# Altium project user_interface.PrjPcb
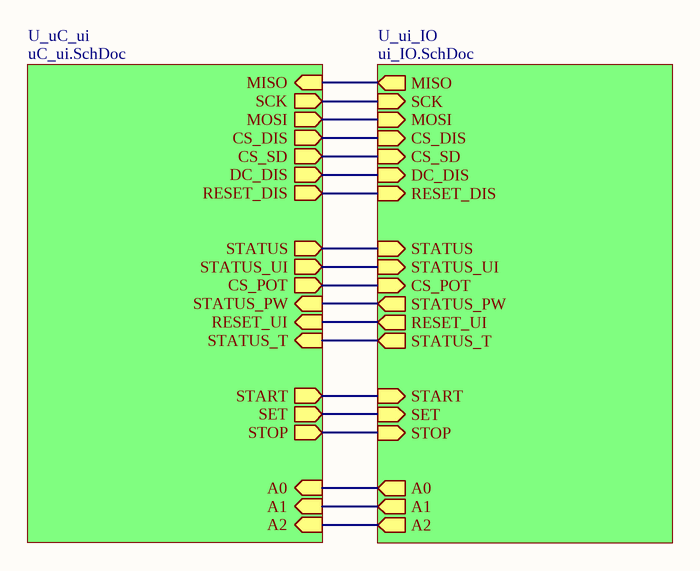
[diagram p0: top_level.SchDoc]
3 sheets, 32 parts. Net scope: hierarchical (ports join the sheet entries above them; power ports are global).
Board file: ui_pcb.PcbDoc
Sheets:
  top_level.SchDoc
    U_uC_ui = uC_ui.SchDoc
    U_ui_IO = ui_IO.SchDoc

## Sheet top_level.SchDoc
size A4

### Sub-sheets
U_uC_ui = uC_ui.SchDoc: A0 (in), A1 (in), A2 (in), CS_SD (out), STATUS_UI (out), STATUS_PW (in), CS_DIS (out), MOSI (out), MISO (in), SCK (out), STATUS_T (in), STATUS (out), SET (out), START (out), STOP (out), CS_POT (out), RESET_DIS (out), DC_DIS (out), RESET_UI (in)
U_ui_IO = ui_IO.SchDoc: MISO (out), RESET_DIS (in), DC_DIS (in), CS_DIS (in), A0 (out), A1 (out), START (in), STOP (in), STATUS_PW (out), STATUS_UI (in), RESET_UI (out), STATUS_T (out), STATUS (in), SET (in), CS_SD (in), CS_POT (in), SCK (in), MOSI (in), A2 (out)

### Nets
MOSI: sheet U_uC_ui/MOSI, sheet U_ui_IO/MOSI
RESET_UI: sheet U_uC_ui/RESET_UI, sheet U_ui_IO/RESET_UI
SCK: sheet U_uC_ui/SCK, sheet U_ui_IO/SCK
STATUS: sheet U_uC_ui/STATUS, sheet U_ui_IO/STATUS
STATUS_PW: sheet U_uC_ui/STATUS_PW, sheet U_ui_IO/STATUS_PW
STATUS_T: sheet U_uC_ui/STATUS_T, sheet U_ui_IO/STATUS_T
STATUS_UI: sheet U_uC_ui/STATUS_UI, sheet U_ui_IO/STATUS_UI
NetJ1_1: sheet U_uC_ui/MISO, sheet U_ui_IO/MISO
NetJ1_4: sheet U_uC_ui/CS_DIS, sheet U_ui_IO/CS_DIS
NetJ1_5: sheet U_uC_ui/CS_SD, sheet U_ui_IO/CS_SD
NetJ1_6: sheet U_uC_ui/DC_DIS, sheet U_ui_IO/DC_DIS
NetJ1_7: sheet U_uC_ui/RESET_DIS, sheet U_ui_IO/RESET_DIS
NetP1_4: sheet U_uC_ui/CS_POT, sheet U_ui_IO/CS_POT
NetP3_3: sheet U_uC_ui/STOP, sheet U_ui_IO/STOP
NetP3_4: sheet U_uC_ui/SET, sheet U_ui_IO/SET
NetP3_5: sheet U_uC_ui/START, sheet U_ui_IO/START
NetR6_1: sheet U_uC_ui/A0, sheet U_ui_IO/A0
NetR9_1: sheet U_uC_ui/A1, sheet U_ui_IO/A1
NetR11_1: sheet U_uC_ui/A2, sheet U_ui_IO/A2

## Sheet uC_ui.SchDoc
size A4
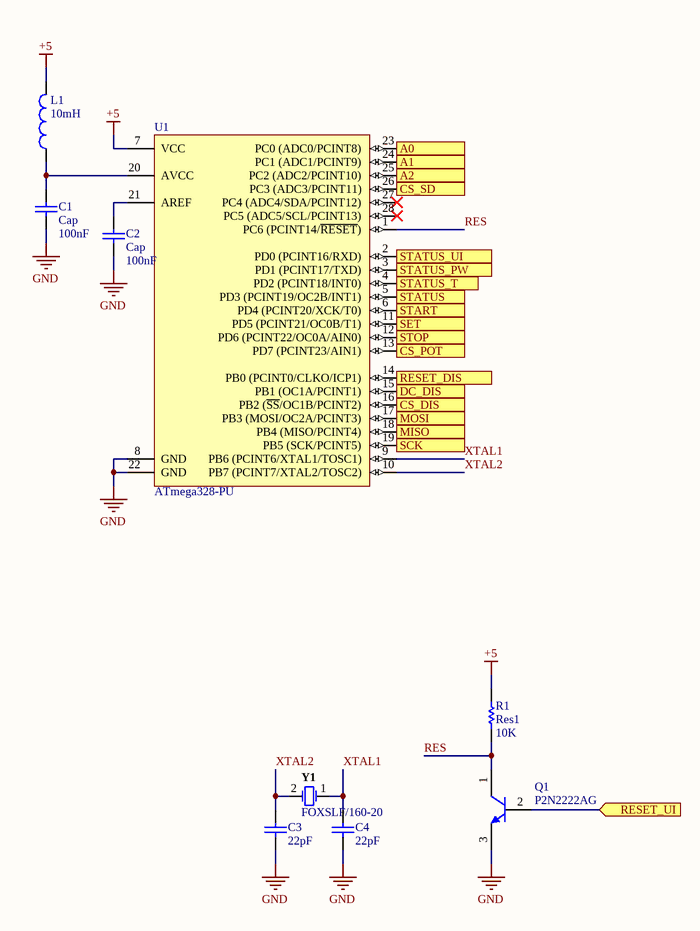
[diagram p1: uC_ui.SchDoc]

### Parts
C1  Cap  value 100nF  [RAD-0.3]
C2  Cap  value 100nF  [RAD-0.3]
C3  value 22pF  [RAD-0.3]  (hidden comment: Cap)
C4  value 22pF  [RAD-0.3]  (hidden comment: Cap)
L1  10mH  [INDR62-500-1100X850X1100]
Q1  P2N2222AG  [ONSC-TO-92-3-29-11]
R1  Res1  value 10K  [AXIAL-0.4]
U1  ATmega328-PU  [28P3]
Y1  FOXSLF/160-20  [FOX-FOXSLF160-20]

### Ports
A0 (in), A1 (in), A2 (in), CS_DIS (out), CS_POT (out), CS_SD (out), DC_DIS (out), MISO (in), MOSI (out), RESET_DIS (out), RESET_UI (in), SCK (out), SET (out), START (out), STATUS (out), STATUS_PW (in), STATUS_T (in), STATUS_UI (out), STOP (out)

### Nets
+5: L1.2 R1.2 U1.7(VCC)
GND: C1.1 C2.1 C3.1 C4.1 Q1.3(E) U1.8(GND) U1.22(GND)
MOSI: U1.17(PB3_(MOSI/OC2A/PCINT3)) ; port MOSI
RES: Q1.1(C) R1.1 U1.1(PC6_(PCINT14/~{RESET}))
RESET_UI: Q1.2(B) ; port RESET_UI
SCK: U1.19(PB5_(SCK/PCINT5)) ; port SCK
STATUS: U1.5(PD3_(PCINT19/OC2B/INT1)) ; port STATUS
STATUS_PW: U1.3(PD1_(PCINT17/TXD)) ; port STATUS_PW
STATUS_T: U1.4(PD2_(PCINT18/INT0)) ; port STATUS_T
STATUS_UI: U1.2(PD0_(PCINT16/RXD)) ; port STATUS_UI
XTAL1: C4.2 U1.9(PB6_(PCINT6/XTAL1/TOSC1)) Y1.1
XTAL2: C3.2 U1.10(PB7_(PCINT7/XTAL2/TOSC2)) Y1.2
NetC1_2: C1.2 L1.1 U1.20(AVCC)
NetC2_2: C2.2 U1.21(AREF)
NetJ1_1: U1.18(PB4_(MISO/PCINT4)) ; port MISO
NetJ1_4: U1.16(PB2_(~{SS}/OC1B/PCINT2)) ; port CS_DIS
NetJ1_5: U1.26(PC3_(ADC3/PCINT11)) ; port CS_SD
NetJ1_6: U1.15(PB1_(OC1A/PCINT1)) ; port DC_DIS
NetJ1_7: U1.14(PB0_(PCINT0/CLKO/ICP1)) ; port RESET_DIS
NetP1_4: U1.13(PD7_(PCINT23/AIN1)) ; port CS_POT
NetP3_3: U1.12(PD6_(PCINT22/OC0A/AIN0)) ; port STOP
NetP3_4: U1.11(PD5_(PCINT21/OC0B/T1)) ; port SET
NetP3_5: U1.6(PD4_(PCINT20/XCK/T0)) ; port START
NetR6_1: U1.23(PC0_(ADC0/PCINT8)) ; port A0
NetR9_1: U1.24(PC1_(ADC1/PCINT9)) ; port A1
NetR11_1: U1.25(PC2_(ADC2/PCINT10)) ; port A2

Not connected (* = marked no-connect by the designer): U1 27(PC4_(ADC4/SDA/PCINT12))* 28(PC5_(ADC5/SCL/PCINT13))*

### Library data of the parts
C1-C4 = Cap: Capacitor; Published: 8-Jun-2000; LatestRevisionDate: 17-Jul-2002; LatestRevisionNote: Re-released for DXP Platform.; PackageReference: RAD-0.3; Publisher: Altium Limited; PackageDescription: Radial Cap, Thru-Hole; 2 Leads; 0.3 in Pin Spacing
L1 = CMP-1747-00016-1: Radial Inductor, 10 uH, +/- 10%, 3 A, -55 to 105 degC, 2-Pin THD, RoHS, Bulk; Outputs: 4; Case\Package: DIP; Output Voltage: 36 V; Interface: Parallel; Min Supply Voltage: 4.5 V; Output Current: 600 mA; Max Operating Temperature: 70 degC; PackageDescription: 2-Pin Radial Lead, Dia 8.5 mm, Pitch 5 mm; Min Operating Temperature: 0 degC; ComponentLink2Description: Datasheet; Mount: Through Hole; PackageReference: INDR62-500-1100X850X1100; REACH SVHC: No SVHC; Width: 0.25 inch; Package Quantity: 25; ComponentLink1Description: Manufacturer URL; Height: 0.25 inch; DatasheetVersion: Aug-10; Packaging: Rail/Tube; Length: 0.75 inch; Max Supply Voltage: 36 V; RoHSCompliant: true; ComponentLink1URL: http://www.bourns.com/; Radiation Hardening: No; Weight: 0.03357 oz; Pins: 16; ComponentLink2URL: http://www.bourns.com/docs/Product-Datasheets/rl622_series.pdf
Q1 = CMP-1048-01402-1: Amplifier Transistor, NPN Silicon, 3-Pin TO-92, Pb-Free, Bulk Box; Manufacturer: On Semiconductor; IC Continuous (A): 0.6; fT Min (MHz): 300; ComponentLink2Description: Datasheet; ComponentLink1Description: Manufacturer URL; ComponentLink2URL: http://www.onsemi.com/pub_link/Collateral/P2N2222A-D.PDF; ComponentLink3Description: Package Specification; RoHS: TRUE; ComponentLink1URL: http://www.onsemi.com/; PartNumber: P2N2222AG; Mounting Technology: Through Hole; PackageReference: TO-92-3-29-11_AM_SL; Polarity: NPN; Packing: Bulk Box; DatasheetVersion: Rev. 7; PackageDescription: 3-Pin Transistor Outline, Body 4.825 x 3.685 mm, Pitch 1.27 mm; PackageVersion: Rev. AM; ComponentLink3URL: http://www.onsemi.cn/pub_link/Collateral/2N6426-D.PDF
R1 = Res1: Resistor; Published: 8-Jun-2000; LatestRevisionDate: 17-Jul-2002; LatestRevisionNote: Re-released for DXP Platform.; PackageReference: AXIAL-0.3; Publisher: Altium Limited; PackageDescription: Axial Device, Thru-Hole; 2 Leads; 0.3 in Pin Spacing
U1 = CMP-0095-00015-2: 8-bit AVR Microcontroller, 32KB Flash, 1KB EEPROM, 2KB SRAM, 28-pin PDIP, Industrial Grade (-40°C to 85°C); ComponentLink3Description: ATmega48A/48PA/88A/88PA/168A/168PA/328/328P Summary; RevisionNote: DatasheetVersion updated. URLs added.; DatasheetVersion: revD, May-2011; ComponentLink1URL: http://www.atmel.com/; PackageVersion: revB, Sep-2001; PackageDescription: 28-lead (0.300"/7.62mm Wide) Plastic Dual Inline Package (PDIP); PackageReference: 28P3; ComponentLink1Description: Manufacturer URL; ComponentLink2Description: ATmega48A/48PA/88A/88PA/168A/168PA/328/328P Datasheet; ComponentLink3URL: http://www.atmel.com/dyn/resources/prod_documents/8271S.pdf; ComponentLink2URL: http://www.atmel.com/dyn/resources/prod_documents/8271.pdf
Y1 = CMP-1749-00003-1: Resistance Weld Thru-Hole Crystal, 16 MHz, -20 to 70 degC, 2-Pin THD, RoHS, Bulk; Voltage Rating: 250 V; Tolerance: 1%; Resistance: 221 kohm; Case\Package: Axial; Power Rating: 250 mW; RoHSCompliant: true; Package Quantity: 200; Packaging: Bulk; Min Operating Temperature: -55 degC; DatasheetVersion: Mar-15; ComponentLink1URL: http://www.foxonline.com/; Max Operating Temperature: 155 degC; PackageReference: FOXSLF160-20; Mount: Through Hole; PackageDescription: 2-Pin Through Hole Device, Body 11.35 x 4.65 mm; ComponentLink1Description: Manufacturer URL; ComponentLink2URL: http://www.foxonline.com/pdfs/hc49slf.pdf; ComponentLink2Description: Datasheet; Length: 0.248 inch

## Sheet ui_IO.SchDoc
size A4
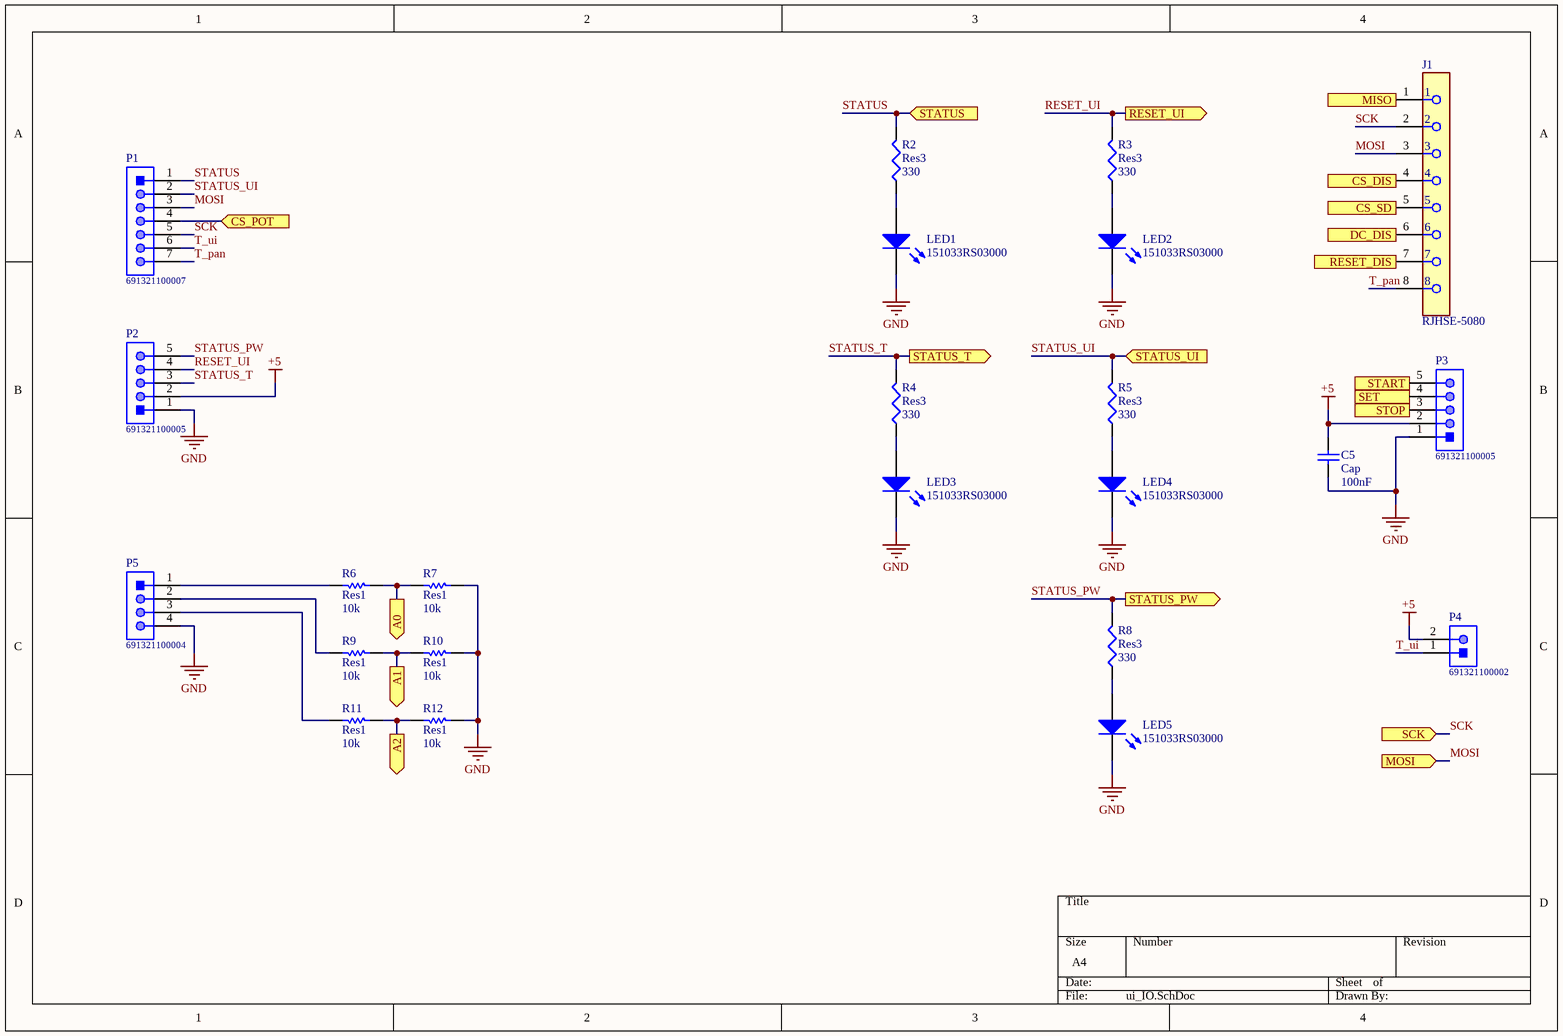
[diagram p2: ui_IO.SchDoc]

### Parts
C5  Cap  value 100nF  [RAD-0.3]
J1  RJHSE-5080  [FP-RJHSE-5080-MFG]
LED1  151033RS03000  [Type 3mm]
LED2  151033RS03000  [Type 3mm]
LED3  151033RS03000  [Type 3mm]
LED4  151033RS03000  [Type 3mm]
LED5  151033RS03000  [Type 3mm]
P1  691321100007  [691321100007]
P2  691321100005  [691321100005]
P3  691321100005  [691321100005]
P4  691321100002  [691321100002]
P5  691321100004  [691321100004]
R2  Res3  value 330  [AXIAL-0.4]
R3  Res3  value 330  [AXIAL-0.4]
R4  Res3  value 330  [AXIAL-0.4]
R5  Res3  value 330  [AXIAL-0.4]
R6  Res1  value 10k  [AXIAL-0.4]
R7  Res1  value 10k  [AXIAL-0.4]
R8  Res3  value 330  [AXIAL-0.4]
R9  Res1  value 10k  [AXIAL-0.4]
R10  Res1  value 10k  [AXIAL-0.4]
R11  Res1  value 10k  [AXIAL-0.4]
R12  Res1  value 10k  [AXIAL-0.4]

### Ports
A0 (out), A1 (out), A2 (out), CS_DIS (in), CS_POT (in), CS_SD (in), DC_DIS (in), MISO (out), MOSI (in), RESET_DIS (in), RESET_UI (out), SCK (in), SET (in), START (in), STATUS (in), STATUS_PW (out), STATUS_T (out), STATUS_UI (in), STOP (in)

### Nets
+5: C5.2 P2.2 P3.2 P4.2
GND: C5.1 LED1.1(K) LED2.1(K) LED3.1(K) LED4.1(K) LED5.1(K) P2.1 P3.1 P5.4 R7.1 R10.1 R12.1
MOSI: J1.3 P1.3 ; port MOSI
RESET_UI: P2.4 R3.2 ; port RESET_UI
SCK: J1.2 P1.5 ; port SCK
STATUS: P1.1 R2.2 ; port STATUS
STATUS_PW: P2.5 R8.2 ; port STATUS_PW
STATUS_T: P2.3 R4.2 ; port STATUS_T
STATUS_UI: P1.2 R5.2 ; port STATUS_UI
T_pan: J1.8 P1.7
T_ui: P1.6 P4.1
NetJ1_1: J1.1 ; port MISO
NetJ1_4: J1.4 ; port CS_DIS
NetJ1_5: J1.5 ; port CS_SD
NetJ1_6: J1.6 ; port DC_DIS
NetJ1_7: J1.7 ; port RESET_DIS
NetLED1_2: LED1.2(A) R2.1
NetLED2_2: LED2.2(A) R3.1
NetLED3_2: LED3.2(A) R4.1
NetLED4_2: LED4.2(A) R5.1
NetLED5_2: LED5.2(A) R8.1
NetP1_4: P1.4 ; port CS_POT
NetP3_3: P3.3 ; port STOP
NetP3_4: P3.4 ; port SET
NetP3_5: P3.5 ; port START
NetP5_1: P5.1 R6.2
NetP5_2: P5.2 R9.2
NetP5_3: P5.3 R11.2
NetR6_1: R6.1 R7.2 ; port A0
NetR9_1: R9.1 R10.2 ; port A1
NetR11_1: R11.1 R12.2 ; port A2

### Library data of the parts
C5 = Cap: Capacitor; Published: 8-Jun-2000; LatestRevisionDate: 17-Jul-2002; LatestRevisionNote: Re-released for DXP Platform.; PackageReference: RAD-0.3; Publisher: Altium Limited; PackageDescription: Radial Cap, Thru-Hole; 2 Leads; 0.3 in Pin Spacing
J1 = CMP-02366-000003-1: CONN MOD JACK 8P8C R/A UNSHLD; Manufacturer: Amphenol; Current Rating: 1.5A; Voltage Rating: 125V; Pitch: 1.02mm; Conn Orientation: Right Angle; Number Of Contacts: 8; Is Female: yes; Conn Gender: Female; Lead Free: Yes; Device Class L3: unset; Footprint Url: https://cdn.amphenol-icc.com/media/wysiwyg/files/drawing/rjhse5080.pdf?__cf_chl_jschl_tk__=e349db0bbbb6188a39347cd5e541b92fa02c9719-1587748343-0-AW7tChdeHzRPLX9gSWj7WrKaXQoY9BsmT9Ek0h-T62M9y3Rs9iypFcOtkzb-6sGYQEjFE-jcoNciDETCOZrh1rYyOesac5SvYLoLwHIsHvF4AKBlx-MXmfZUVk9OTTJLqyQq2qMm0PFRLJpNcK0nrKResqOniRSYixG2sPTmOPraH-ULJFBDL602CHqcI9KKBgTq90Jh1OL2Td4moJ99rFsJRJ1Tk_uoxGe8ublcP_ARu-uLpWcQrBcwOcHDTAwL29DAwVaqcH7ta8Ks7WMlHmVl_pILeEDwT0bE9vu5Pa5S3PtNRF1leuFkgi_FMbUxTDulc5xzbXSfng8srUIV1lWXny5nx1fZJEUa_w97yKjffzBMxiWLWVN-V7-uqAaPbyv_m-wRyw5O25OZNyJOeGU; ComponentLink2URL: https://cdn.amphenol-icc.com/media/wysiwyg/files/documentation/datasheet/inputoutput/io-modjack-rjhse.pdf; Device Class L1: Connectors; Package: CONN_MOD_JACK; Mouser Description: Modular Connectors / Ethernet Connectors R/A RJ45 NONSHIELDED 8 CONT NO LEDS; Manufacturer Part Number: RJHSE-5080; Octopart: https://octopart.com/rjhse-5080-amphenol-45060; Category: Conn; Height: 0.535inch; Temperature: -55°C to +85°C; Digikey Description: CONN MOD JACK 8P8C R/A UNSHLD; Device Class L2: Modular / Ethernet Connectors; Contact Material: Gold,Nickel; ComponentLink2Description: Datasheet; Temperature Range Low: -55°C; RoHS: TRUE; Automotive: No; Temperature Range High: +85°C
LED1-LED5 = CMP-1489-00004-1: THT LED round mono-color waterclear, WL-TMRW, Red; Manufacturer: Wuerth Elektronik; ComponentLink1URL: http://www.we-online.com; PartNumber: 151033RS03000; ComponentLink1Description: Manufacturer URL; PackageReference: Type 3mm; ComponentLink2Description: Datasheet; Emitting color: Red; ComponentLink2URL: http://katalog.we-online.de/pbs/datasheet/7448042001.pdfhttp://katalog.we-online.de/pbs/datasheet/7448042001.pdfhttp://katalog.we-online.de/pbs/datasheet/7448042001.pdfhttp://katalog.we-online.de/pbs/datasheet/151033RS03000.pdf
P1 = CMP-1502-01788-1: Serie 3211 - 3.50mm Vertical PCB Header WR-TBL, 7 pin; Manufacturer: Wurth Elektronik; Gender: Male; Pin Number: 7; Manufacturer URL: http://www.we-online.de; Package Reference: 691321100007; Part Number: 691321100007; Packaging: Box; Publisher: WurthElektronik; Operating Temperature: -40to105degC; Pitch: 3.50mm; Mounting Technology: THT; Datasheet URL: http://katalog.we-online.de/em/datasheet/6913211000xx.pdf
P2 P3 = CMP-1502-01786-1: Serie 3211 - 3.50mm Vertical PCB Header WR-TBL, 5 pin; Manufacturer: Wurth Elektronik; Pin Number: 5; Gender: Male; Datasheet URL: http://katalog.we-online.de/em/datasheet/6913211000xx.pdf; Package Reference: 691321100005; Manufacturer URL: http://www.we-online.de; Pitch: 3.50mm; Operating Temperature: -40to105degC; Publisher: WurthElektronik; Packaging: Box; Part Number: 691321100005; Mounting Technology: THT
P4 = CMP-1502-01783-1: Serie 3211 - 3.50mm Vertical PCB Header WR-TBL, 2 pin; Manufacturer: Wurth Elektronik; Gender: Male; Pin Number: 2; Part Number: 691321100002; Mounting Technology: THT; Manufacturer URL: http://www.we-online.de; Datasheet URL: http://katalog.we-online.de/em/datasheet/6913211000xx.pdf; Packaging: Box; Package Reference: 691321100002; Publisher: WurthElektronik; Pitch: 3.50mm; Operating Temperature: -40to105degC
P5 = CMP-1502-01785-1: Serie 3211 - 3.50mm Vertical PCB Header WR-TBL, 4 pin; Manufacturer: Wurth Elektronik; Gender: Male; Pin Number: 4; Operating Temperature: -40to105degC; Packaging: Box; Package Reference: 691321100004; Part Number: 691321100004; Mounting Technology: THT; Pitch: 3.50mm; Publisher: WurthElektronik; Manufacturer URL: http://www.we-online.de; Datasheet URL: http://katalog.we-online.de/em/datasheet/6913211000xx.pdf
R2-R5 R8 = Res3: Resistor; Published: 8-Jun-2000; LatestRevisionDate: 29-May-2009; LatestRevisionNote: IPC-7351 Footprint Added.; PackageReference: J1-0603; Publisher: Altium Limited; PackageDescription: Chip Resistor
R6 R7 R9-R12 = Res1: Resistor; Published: 8-Jun-2000; LatestRevisionDate: 17-Jul-2002; LatestRevisionNote: Re-released for DXP Platform.; PackageReference: AXIAL-0.3; Publisher: Altium Limited; PackageDescription: Axial Device, Thru-Hole; 2 Leads; 0.3 in Pin Spacing

## Nets that join several sheets
+5: uC_ui (L1.2 R1.2 U1.7), ui_IO (C5.2 P2.2 P3.2 P4.2)
GND: uC_ui (7 pins), ui_IO (12 pins)
MOSI: uC_ui (U1.17), ui_IO (J1.3 P1.3)
NetJ1_1: uC_ui (U1.18), ui_IO (J1.1)
NetJ1_4: uC_ui (U1.16), ui_IO (J1.4)
NetJ1_5: uC_ui (U1.26), ui_IO (J1.5)
NetJ1_6: uC_ui (U1.15), ui_IO (J1.6)
NetJ1_7: uC_ui (U1.14), ui_IO (J1.7)
NetP1_4: uC_ui (U1.13), ui_IO (P1.4)
NetP3_3: uC_ui (U1.12), ui_IO (P3.3)
NetP3_4: uC_ui (U1.11), ui_IO (P3.4)
NetP3_5: uC_ui (U1.6), ui_IO (P3.5)
NetR6_1: uC_ui (U1.23), ui_IO (R6.1 R7.2)
NetR9_1: uC_ui (U1.24), ui_IO (R9.1 R10.2)
NetR11_1: uC_ui (U1.25), ui_IO (R11.1 R12.2)
RESET_UI: uC_ui (Q1.2), ui_IO (P2.4 R3.2)
SCK: uC_ui (U1.19), ui_IO (J1.2 P1.5)
STATUS: uC_ui (U1.5), ui_IO (P1.1 R2.2)
STATUS_PW: uC_ui (U1.3), ui_IO (P2.5 R8.2)
STATUS_T: uC_ui (U1.4), ui_IO (P2.3 R4.2)
STATUS_UI: uC_ui (U1.2), ui_IO (P1.2 R5.2)